# EAGLE design working (EAGLE 6.3)
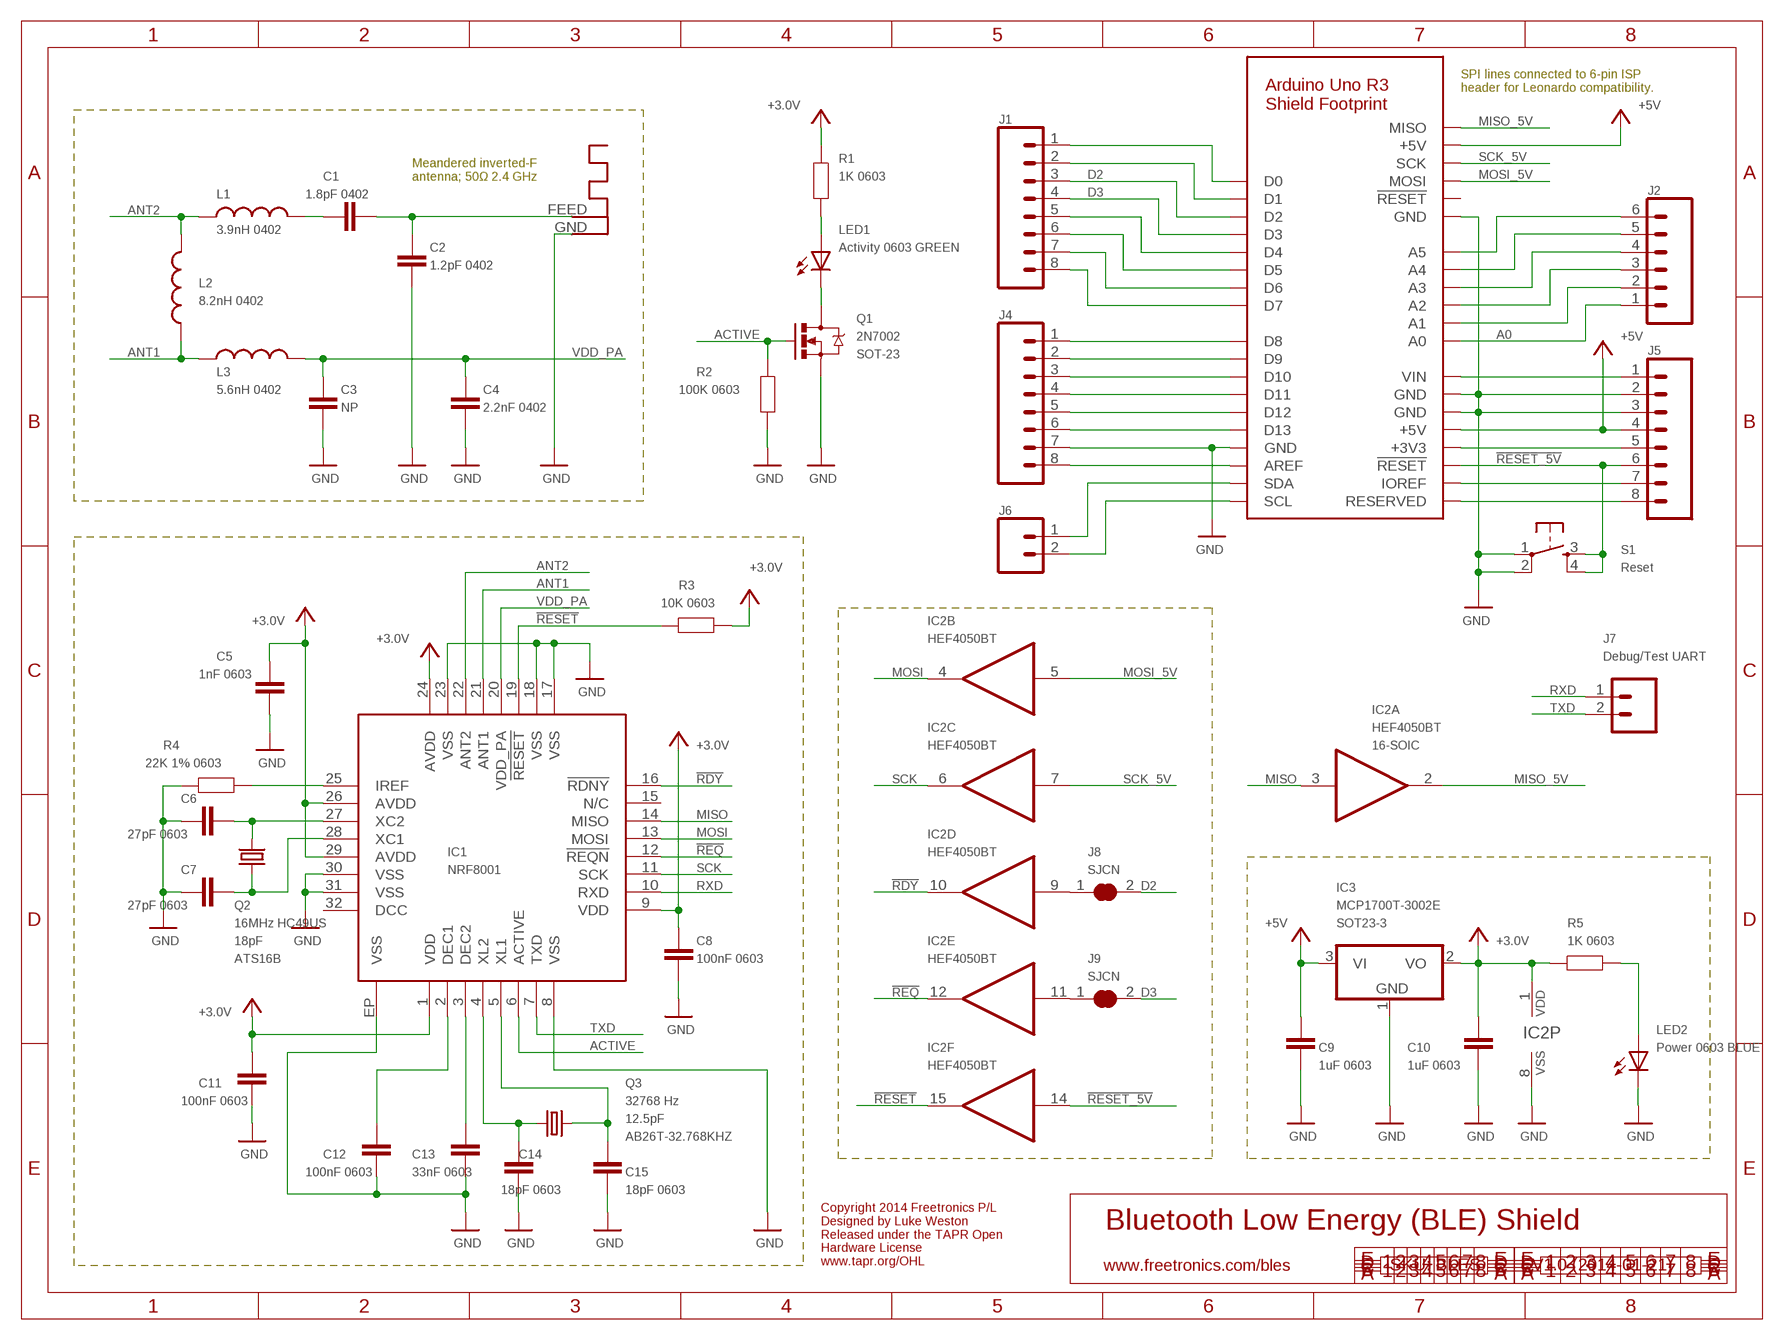
[diagram p0: schematic, sheet 1]

## Parts
ANT1  ANTENNA  [RN-ANT]
C1  1.8pF 0402  CAP0402  [C0402]
C2  1.2pF 0402  CAP0402  [C0402]
C3  NP  CAP0402  [C0402]
C4  2.2nF 0402  CAP0402  [C0402]
C5  1nF 0603  CAP0603  [0603]
C6  27pF 0603  CAP0603  [0603]
C7  27pF 0603  CAP0603  [0603]
C8  100nF 0603  CAP0603  [0603]
C9  1uF 0603  CAP0603  [0603]
C10  1uF 0603  CAP0603  [0603]
C11  100nF 0603  CAP0603  [0603]
C12  100nF 0603  CAP0603  [0603]
C13  33nF 0603  CAP0603  [0603]
C14  18pF 0603  CAP0603  [0603]
C15  18pF 0603  CAP0603  [0603]
IC1  NRF8001  FITNESSDEVICE_NRF8001  [FITNESSDEVICE_QFN-32]
IC2  HEF4050BT  4050D  [SO16]
IC3  MCP1700T-3002E  MCP1703CB  [SOT23]
J1  M08STD  [1X08]
J2  M06SIP  [1X06]
J3  ARDUINO-SHIELD_R3  [ARDUINO-SHIELD_R3]
J4  M08STD  [1X08]
J5  M08STD  [1X08]
J6  M02PTH  [1X02]
J7  Debug/Test UART  M02PTH  [1X02]
J8  SJCN  [SJC]
J9  SJCN  [SJC]
L1  3.9nH 0402  INDUCTOR0402  [C0402]
L2  8.2nH 0402  INDUCTOR0402  [C0402]
L3  5.6nH 0402  INDUCTOR0402  [C0402]
LED1  Activity 0603 GREEN  LED0603  [LED-0603]
LED2  Power 0603 BLUE  LED0603  [LED-0603]
Q1  2N7002  [SOT23-3]
Q2  16MHz HC49US  CRYSTALHC49UV  [HC49U-V]
Q3  32768 Hz  CRYSTALTC26H  [TC26H]
R1  1K 0603  RESISTOR0603  [0603]
R2  100K 0603  RESISTOR0603  [0603]
R3  10K 0603  RESISTOR0603  [0603]
R4  22K 1% 0603  RESISTOR0603  [0603]
R5  1K 0603  RESISTOR0603  [0603]
S1  Reset  TAC_SWITCHSMD  [TACTILE_SWITCH_SMD]

## Nets
!RDY: IC1.16(!RDNY) IC2.10(D:O)
!REQ: IC1.12(!REQN) IC2.12(E:O)
!RESET: IC1.19(!RESET) IC2.15(F:O) R3.2
!RESET_5V: IC2.14(F:I) J3.!RESET J5.6 S1.3 S1.4
+3.0V: C5.2 C8.2 C10.2 C11.2 IC1.1(VDD) IC1.9(VDD) IC1.24(AVDD) IC1.26(AVDD) IC1.29(AVDD) IC2.1(P:VDD) IC3.2(VO) R1.1 R3.1 R5.2
+3.3V: J3.3V3(+3V3) J5.5
+5V: C9.2 IC3.3(VI) J3.+5V J3.+5V@0(+5V) J5.4
A0: J2.1 J3.A0
ACTIVE: IC1.6(ACTIVE) Q1.1(G) R2.1
ANT1: IC1.21(ANT1) L2.2 L3.1
ANT2: IC1.22(ANT2) L1.2 L2.1
C: IC2.9(D:I) J8.1
D: IC2.11(E:I) J9.1
D2: J1.3 J3.D2 J8.2
D3: J1.4 J3.D3 J9.2
GND: ANT1.GND C2.1 C3.1 C4.1 C5.1 C6.1 C7.1 C8.1 C9.1 C10.1 C11.1 C12.1 C13.1 C14.1 C15.1 IC1.8(VSS) IC1.17(VSS) IC1.18(VSS) IC1.23(VSS) IC1.30(VSS) IC1.31(VSS) IC1.EP(VSS) IC2.8(P:VSS) IC3.1(GND) J3.GND J3.GND@0(GND) J3.GND@1(GND) J3.GND@2(GND) J4.7 J5.2 J5.3 LED2.C Q1.2(S) R2.2 R4.2 S1.1 S1.2
MISO: IC1.14(MISO) IC2.3(A:I)
MISO_5V: IC2.2(A:O) J3.MISO
MOSI: IC1.13(MOSI) IC2.4(B:O)
MOSI_5V: IC2.5(B:I) J3.MOSI
N$1: C12.2 IC1.2(DEC1)
N$2: C13.2 IC1.3(DEC2)
N$3: IC1.25(IREF) R4.1
N$4: C7.2 IC1.28(XC1) Q2.1
N$5: C6.2 IC1.27(XC2) Q2.2
N$6: C14.2 IC1.4(XL2) Q3.1
N$7: C15.2 IC1.5(XL1) Q3.2
N$8: ANT1.FEED C1.1 C2.2
N$13: C1.2 L1.1
N$14: LED2.A R5.1
N$15: LED1.C Q1.3(D)
N$17: LED1.A R1.2
N$27: J2.2 J3.A1
N$37: J2.3 J3.A2
N$50: J2.4 J3.A3
N$72: J2.5 J3.A4
N$73: J2.6 J3.A5
N$74: J3.RESERVED J5.8
N$75: J3.VIN J5.1
N$81: J3.IOREF J5.7
N$82: J1.1 J3.D0
N$87: J1.2 J3.D1
N$90: J1.5 J3.D4
N$123: J1.6 J3.D5
N$124: J1.7 J3.D6
N$125: J1.8 J3.D7
N$126: J3.SDA J6.1
N$127: J3.AREF J4.8
N$128: J3.D13 J4.6
N$129: J3.D12 J4.5
N$130: J3.SCL J6.2
N$131: J3.D8 J4.1
N$132: J3.D9 J4.2
N$133: J3.D10 J4.3
N$134: J3.D11 J4.4
RXD: IC1.10(RXD) J7.1
SCK: IC1.11(SCK) IC2.6(C:O)
SCK_5V: IC2.7(C:I) J3.SCK
TXD: IC1.7(TXD) J7.2
VDD_PA: C3.2 C4.2 IC1.20(VDD_PA) L3.2
Unconnected: IC1.15(N/C) IC1.32(DCC) J3.!RESET@0(!RESET)

## Notes on the sheet
- SPI lines connected to 6-pin ISP
  header for Leonardo compatibility.
- Meandered inverted-F
  antenna; 50Ω 2.4 GHz
- Bluetooth Low Energy (BLE) Shield
- Copyright 2014 Freetronics P/L
  Designed by Luke Weston
  Released under the TAPR Open
  Hardware License
  www.tapr.org/OHL
- www.freetronics.com/bles | SKU: BLES | V1.0 (2014-01-21)

## Library data of the parts
ANT1 = adafruit:ANTENNA
C1-C4 = freetronics-master-v1:CAP: Capacitor Standard 0603 ceramic capacitor, and 0.1" leaded capacitor.; PACKAGE: 0402
C5-C15 = freetronics-master-v1:CAP: Capacitor Standard 0603 ceramic capacitor, and 0.1" leaded capacitor.; PACKAGE: 0603
IC1 = bluetooth:FITNESSDEVICE_NRF8001: nRF8001 is a Bluetooth® low energy solution designed for operation in the peripheral role. By integrating a Bluetooth low energy compliant radio (PHY), slave mode link controller and host, nRF8001 offers you an easy way to add Bluetooth low energy connectivity to your application.; VALUE2: NRF8001
IC2 = 40xx:4050: Hex non-inverting BUFFER; PACKAGE: 16-SOIC
IC3 = linear:MCP1703: 250 mA, 16V, Low Quiescent Current LDO Regulator Source: http://ww1.microchip.com/downloads/en/DeviceDoc/22049b.pdf; PACKAGE: SOT23-3
J1 J4 J5 = freetronics-master-v1:M08: Header 8 Standard 8-pin 0.1" header. Use with straight break away headers (SKU : PRT-00116), right angle break away headers (PRT-00553), swiss pins (PRT-00743), machine pins (PRT-00117), and female headers (PRT-00115).
J2 = freetronics-master-v1:M06: Header 6 Standard 6-pin 0.1" header. Use with straight break away headers (SKU : PRT-00116), right angle break away headers (PRT-00553), swiss pins (PRT-00743), machine pins (PRT-00117), and female headers (PRT-00115). Molex polarized connector foot print use with SKU : PRT-08094 with associated crimp pins and housings. NOTES ON THE VARIANTS LOCK and LOCK_LONGPADS... This footprint was designed to help hold the alignment of a through-hole component (i.e. 6-pin header) while soldering it into place. You may notice that each hole has been shifted either up or down by 0.005 of an inch from it's more standard position (which is a perfectly straight line). This slight alteration caused the pins (the squares in the middle) to touch the edges of the holes. Because they are alternating, it causes a "brace" to hold the component in place. 0.005 has proven to be the perfect amount of "off-center" position when using our standard breakaway headers. Although looks a little odd when you look at the bare footprint, once you have a header in there, the alteration is very hard to notice. Also, if you push a header all the way into place, it is covered up entirely on the bottom side. This idea of altering the position of holes to aid alignment will be further integrated into the Sparkfun Library for other footprints. It can help hold any component with 3 or more connection pins.
J3 = freetronics-luke:ARDUINO-SHIELD_R3: Arduino Uno/Eleven/Leonardo shield, R3 compatible.
J6 J7 = freetronics-master-v1:M02: Header 2 Standard 2-pin 0.1" header. Use with straight break away headers (SKU : PRT-00116), right angle break away headers (PRT-00553), swiss pins (PRT-00743), machine pins (PRT-00117), and female headers (PRT-00115). Molex polarized connector foot print use with SKU : PRT-08233 with associated crimp pins and housings.
J8 J9 = freetronics-jon:SJC
L1-L3 = freetronics-master-v1:INDUCTOR: Inductors Basic Inductor/Choke - 0603 and 1206. Footprints are not proven and vary greatly between part numbers.; PACKAGE: 0402
LED1 = freetronics-master-v1:LED: LEDs Standard schematic elements and footprints for 5mm, 3mm, 1206, and 0603 sized LEDs. 5mm - Spark Fun Electronics SKU : COM-00529 (and others); COLOUR: Green; PACKAGE: 0603
LED2 = freetronics-master-v1:LED: LEDs Standard schematic elements and footprints for 5mm, 3mm, 1206, and 0603 sized LEDs. 5mm - Spark Fun Electronics SKU : COM-00529 (and others); COLOUR: Blue; PACKAGE: 0603
Q1 = freetronics-luke:2N7002: 2N7002 N-ch MOSFET in SOT-23.; PACKAGE: SOT-23
Q2 = freetronics-master-v1:CRYSTAL: Crystals Various standard crystals. Proven footprints. Spark Fun Electronics SKU : COM-00534; CAPACITANCE: 18pF; ID: ATS16B; PACKAGE: HC49US
Q3 = SparkFun:CRYSTAL: Crystals Various standard crystals. Proven footprints. Spark Fun Electronics SKU : COM-00534; CAPACITANCE: 12.5pF; ID: AB26T-32.768KHZ
R1-R5 = freetronics-master-v1:RESISTOR: Resistor Basic schematic elements and footprints for 0603, 1206, and PTH 1/10th watt (small) resistors.; PACKAGE: 0603
S1 = freetronics:TAC_SWITCH: Momentary Switch Button commonly used for reset or general input. Spark Fun Electronics SKU : COM-00097

## Board
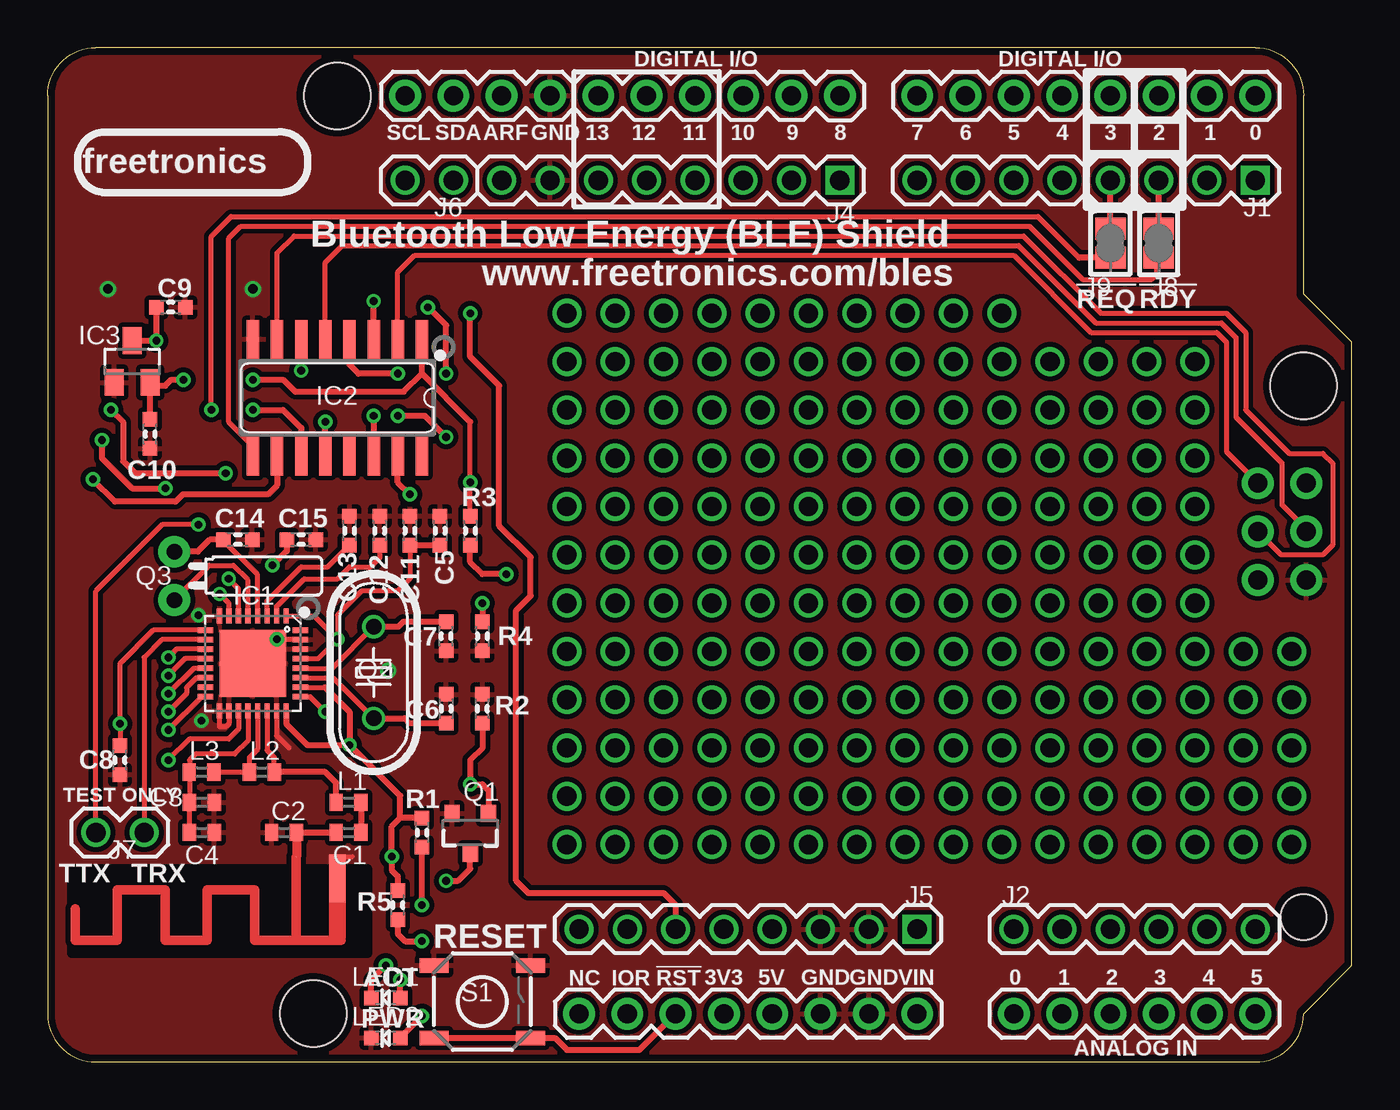
[diagram p1: board, top side]
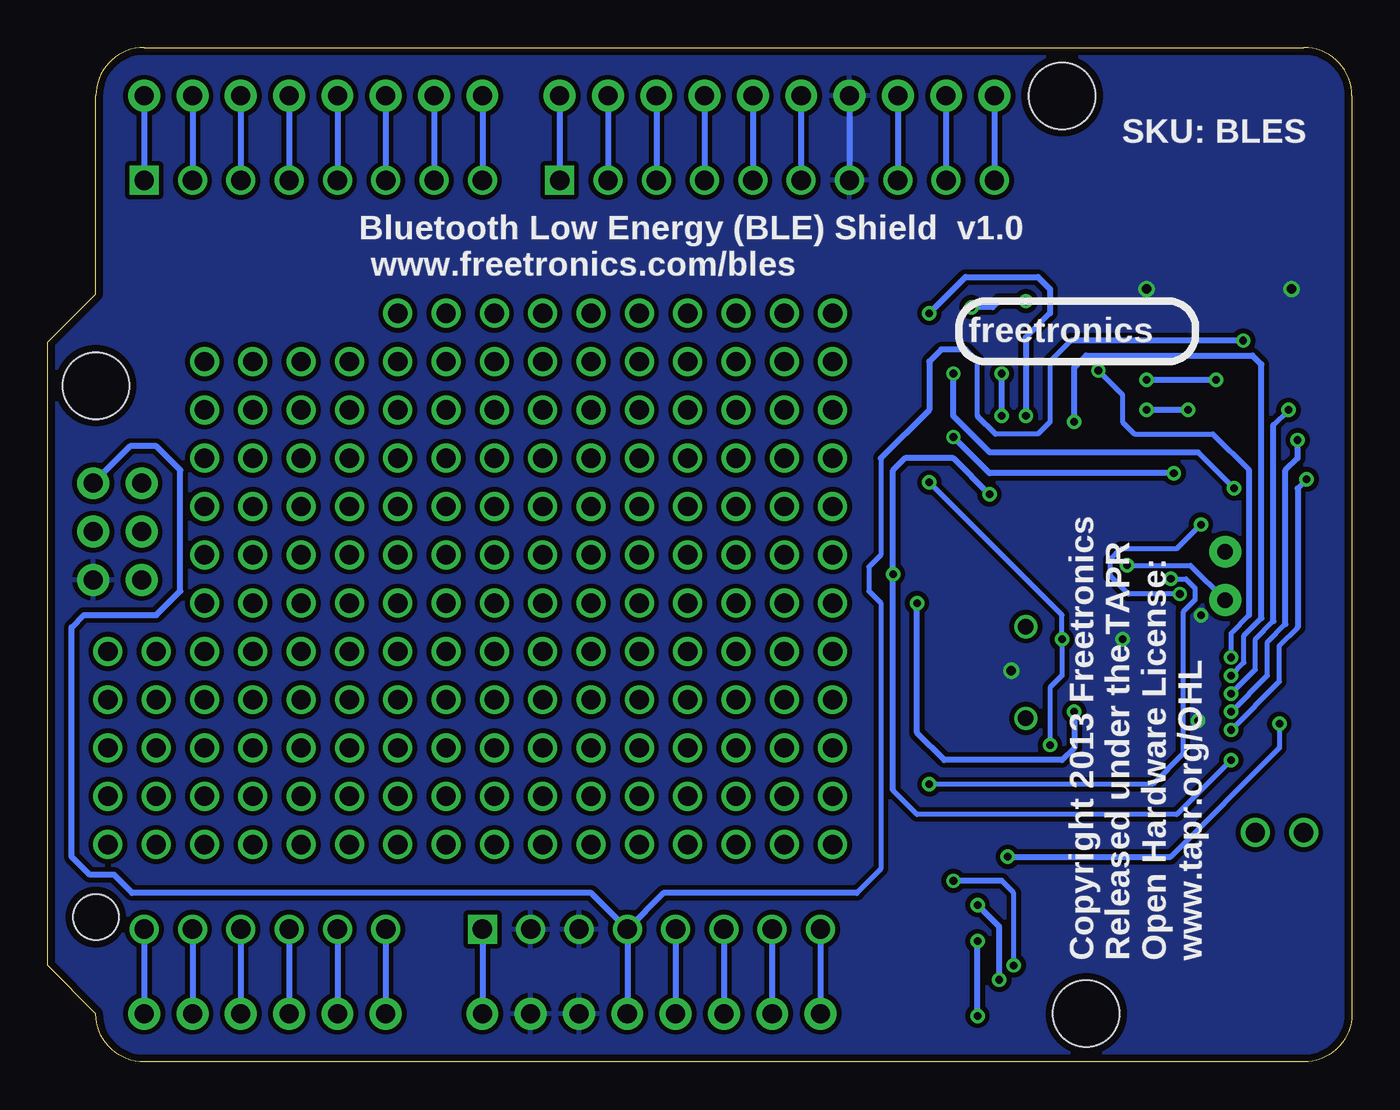
[diagram p2: board, bottom side, seen from below]

Size 68.58 x 53.34 mm. Coordinates in mm from the lower left corner, seen from the top.
Copper layers (1*16): Top 0.0356mm / dielectric 1.5011mm / Bottom 0.0356mm
Design rules "LaenPCBOrder *": minimum track width 6mil, minimum drill 13mil, track to track 6mil, track to pad 6mil, pad to pad 6mil, via to via 6mil, smd to smd 6mil, copper to edge 15mil, drill to drill 6mil, minimum pad ring 7mil, minimum via ring 7mil, stop-mask expansion 4mil, vias tented up to drill 16mil, thermal gap 10mil
tRestrict: area 1.3,5.7 to 16.8,10.2

### Footprints (pad centres in the part's own frame; a part is rotated, then mirrored left to right if it is on the bottom)
RN-ANT = smd 0.025 x 0.025: FEED 0,2.159 | smd 2.54 x 0.889: GND -1.143,0
C0402 = smd 0.7 x 0.9: 1 -0.65,0; 2 0.65,0
0603 = smd 0.762 x 0.762: 1 -0.762,0; 2 0.762,0
FITNESSDEVICE_QFN-32 = smd 0.285 x 0.8: 1 -1.75,-2.5; 2 -1.25,-2.5; 3 -0.75,-2.5; 4 -0.25,-2.5; 5 0.25,-2.5; 6 0.75,-2.5; 7 1.25,-2.5; 8 1.75,-2.5; 17 1.75,2.5; 18 1.25,2.5; 19 0.75,2.5; 20 0.25,2.5; 21 -0.25,2.5; 22 -0.75,2.5; 23 -1.25,2.5; 24 -1.75,2.5 | smd 0.8 x 0.285: 9 2.5,-1.75; 10 2.5,-1.25; 11 2.5,-0.75; 12 2.5,-0.25; 13 2.5,0.25; 14 2.5,0.75; 15 2.5,1.25; 16 2.5,1.75; 25 -2.5,1.75; 26 -2.5,1.25; 27 -2.5,0.75; 28 -2.5,0.25; 29 -2.5,-0.25; 30 -2.5,-0.75; 31 -2.5,-1.25; 32 -2.5,-1.75 | smd 3.5 x 3.5: EP 0,0
SO16 = smd 0.66 x 2.032: 1 -4.445,-3.073; 2 -3.175,-3.073; 3 -1.905,-3.073; 4 -0.635,-3.073; 5 0.635,-3.073; 6 1.905,-3.073; 7 3.175,-3.073; 8 4.445,-3.073; 9 4.445,3.073; 10 3.175,3.073; 11 1.905,3.073; 12 0.635,3.073; 13 -0.635,3.073; 14 -1.905,3.073; 15 -3.175,3.073; 16 -4.445,3.073
SOT23 = smd 1 x 1.4: 1 -0.95,-1.1; 2 0.95,-1.1; 3 0,1.1
1X08 = drill 1.016 square: 1 0,0 | drill 1.016: 2 2.54,0; 3 5.08,0; 4 7.62,0; 5 10.16,0; 6 12.7,0; 7 15.24,0; 8 17.78,0
1X06 = drill 1.016: 1 0,0; 2 2.54,0; 3 5.08,0; 4 7.62,0; 5 10.16,0; 6 12.7,0
ARDUINO-SHIELD_R3 = drill 1 pad 1.676: 3V3 0,-24.13; !RESET -2.54,-24.13; !RESET@0 28.08,-1.32; +5V 2.54,-24.13; +5V@0 30.62,3.76; A0 15.24,-24.13; A1 17.78,-24.13; A2 20.32,-24.13; A3 22.86,-24.13; A4 25.4,-24.13; A5 27.94,-24.13; AREF -11.684,24.13; D0 27.94,24.13; D1 25.4,24.13; D2 22.86,24.13; D3 20.32,24.13; D4 17.78,24.13; D5 15.24,24.13; D6 12.7,24.13; D7 10.16,24.13; D8 6.096,24.13; D9 3.556,24.13; D10 1.016,24.13; D11 -1.524,24.13; D12 -4.064,24.13; D13 -6.604,24.13; GND 7.62,-24.13; GND@0 5.08,-24.13; GND@1 -9.144,24.13; GND@2 30.62,-1.32; IOREF -5.08,-24.13; MISO 28.08,3.76; MOSI 30.62,1.22; RESERVED -7.62,-24.13; SCK 28.08,1.22; SCL -16.764,24.13; SDA -14.224,24.13; VIN 10.16,-24.13 | hole 3.5: 30.48,8.89; -20.32,24.13; -21.59,-24.13 | hole 2.4: 30.48,-19.05
1X02 = drill 1.016: 1 0,0; 2 2.54,0
SJC = smd 1.168 x 1.6: 1 -0.762,0; 2 0.762,0
LED-0603 = smd 0.762 x 0.762: A -0.762,0; C 0.762,0
SOT23-3 = smd 0.8 x 0.9: 1 -0.95,-1; 2 0.95,-1; 3 0,1.1
HC49U-V = drill 0.813: 1 -2.413,0; 2 2.413,0
TC26H = drill 0.813 pad 1.676: 1 -1.27,0; 2 1.27,0
TACTILE_SWITCH_SMD = smd 1.524 x 0.762: 1 -2.54,1.905; 2 2.54,1.905; 3 -2.54,-1.905; 4 2.54,-1.905

### Placement (x,y rotation side)
ANT1  15.24,10.79 90 top
C1  15.82,12.06 0 top
C2  12.43,12.06 0 top
C3  8.12,13.65 180 top
C4  8.12,12.06 180 top
C5  20.64,27.94 270 top
C6  20.95,18.57 270 top
C7  20.95,22.38 90 top
C8  3.81,15.88 90 top
C9  6.48,39.69 180 top
C10  5.39,33.02 90 top
C11  19.05,27.94 270 top
C12  17.46,27.94 270 top
C13  15.88,27.94 270 top
C14  10,27.46 180 top
C15  13.34,27.46 180 top
IC1  10.79,20.95 180 top
IC2  15.24,34.92 180 top
IC3  4.45,36.83 0 top
J1  63.5,46.35 180 top
J2  50.8,6.99 0 top
J3  35.56,26.67 0 top
J4  41.66,46.35 180 top
J5  45.72,6.99 180 top
J6  21.34,46.35 180 top
J7  5.08,12.06 180 top
J8  58.42,43.05 90 top
J9  55.88,43.05 90 top
L1  15.82,13.65 180 top
L2  11.27,15.24 180 top
L3  8.1,15.24 180 top
LED1  17.78,3.37 180 top
LED2  17.78,1.27 180 top
Q1  22.23,12.06 180 top
Q2  17.14,20.48 270 top
Q3  6.67,25.56 270 top
R1  19.68,12.06 270 top
R2  22.86,18.57 90 top
R3  22.23,27.94 270 top
R4  22.86,22.38 270 top
R5  18.41,8.26 90 top
S1  22.86,3.17 0 top

### Tracks (layer width: path | path; a pad name or v marks a point on that pad's centre or on a via)
!RDY  (via drill 0.4 pad 0.61)
  Top 0.254: IC1.16 8.09,19.2 v6.35,17.46
  Top 0.305: IC2.10 12.06,30.32 11.59,29.84 7.11,29.84 6.73,29.46 3.56,29.46 v2.38,30.64
  Bottom 0.254: v6.35,17.46 3.81,20 3.81,21.91 2.86,22.86 | v2.38,30.64 2.86,30.16
  Bottom 0.305: 2.86,30.16 2.86,22.86
!REQ  (via drill 0.4 pad 0.61)
  Top 0.254: IC1.12 7.24,21.2 v6.35,20.32
  Top 0.305: IC2.12 v14.61,33.66
  Bottom 0.254: v6.35,20.32 5.67,21 5.67,22.42 4.76,23.34
  Bottom 0.305: 4.76,23.34 4.76,36.67 5.24,37.15 13.97,37.15 14.61,36.51 v14.61,33.66
!RESET  (via drill 0.4 pad 0.61)
  Top 0.254: IC1.19 10.04,17.51 9.53,16.99 7.46,16.99 v6.35,15.88 | 18.41,31.11 IC2.15 | R3.2 22.23,27.15
  Top 0.305: v19.05,29.84 18.41,30.48 IC2.15 | v24.13,25.65 22.86,25.65 22.23,26.29 R3.2
  Bottom 0.254: v6.35,15.88 9.21,13.02 22.86,13.02 24.13,14.29
  Bottom 0.305: 24.13,14.29 v24.13,25.65 24.13,31.11 23.5,31.75 20.95,31.75 v19.05,29.84
!RESET_5V  (via drill 0.4)
  Top 0.305: v17.14,33.97 IC2.14 | v22.23,39.37 22.23,37.08 23.75,35.56 23.75,28.19 25.4,26.54 25.4,24.51 24.64,23.75 24.64,9.53 25.27,8.89 32.38,8.89 33.02,8.26 J5.6 | J3.!RESET 31.11,0.64 27.3,0.64 26.67,1.27 S1.4 S1.3
  Bottom 0.305: J5.6 J3.!RESET | v22.23,39.37 20.32,41.27 16.51,41.27 15.88,40.64 15.88,39.37 17.14,38.1 v17.14,33.97
+3.0V  (via drill 0.4 pad 0.61)
  Top 0.254: 5.57,35.56 IC3.2 | IC1.9 5.56,22.7 3.81,20.95 v3.81,17.78 C8.2 | IC1.26 14.59,19.7 | IC1.29 14.22,21.2 v15.24,22.23 | IC1.1 14.01,23.45 v15.24,22.23 | C11.2 19.05,25.4 18.41,24.77 16.51,24.77 15.24,23.5 v15.24,22.23 | R3.1 v22.23,30.48 22.23,33.66
  Top 0.305: C10.2 IC3.2 | IC1.24 12.54,17.78 13.65,16.67 v15.88,16.67 | 19.68,36.2 18.73,35.24 13.02,35.24 12.38,35.88 v10.79,35.88 | 5.57,35.56 6.19,35.56 6.51,35.88 v7.14,35.88 | 14.59,19.7 15.88,18.41 v15.88,16.67 | C11.2 C5.2 | v15.88,16.67 18.54,14 18.54,12.83 | 22.23,33.66 19.68,36.2 | R1.1 18.54,12.83 | 18.54,12.83 18.1,12.38 v18.1,10.79 18.1,10.08 18.41,9.76 R5.2 | 19.68,36.2 IC2.1
  Top 0.406: IC3.2
  Bottom 0.254: v22.23,30.48 15.24,23.5 v15.24,22.23 15.24,20.32 15.88,19.68 v15.88,16.67 | 9.53,10.79 3.81,16.51 v3.81,17.78
  Bottom 0.305: v10.79,35.88 v7.14,35.88 | v18.1,10.79 9.53,10.79
+3.3V
  Bottom 0.305: J5.5 J3.3V3
+5V  (via drill 0.4)
  Top 0.305: IC3.3 v5.71,37.93 C9.2
  Bottom 0.254: 14.78,37.93 15.88,36.83 15.88,33.66 16.51,33.02 18.73,33.02 | 19.68,33.97 19.68,36.83 | 24.77,31.75 24.77,26.67 25.4,26.04 25.4,24.77 24.77,24.13 24.77,10.16 26.04,8.89
  Bottom 0.305: v5.71,37.93 14.78,37.93 | 18.73,33.02 19.68,33.97 | J5.4 J3.+5V | J5.4 40.01,8.89 64.14,8.89 65.09,9.84 66.36,9.84 67.31,10.79 67.31,22.86 66.67,23.5 62.87,23.5 61.59,24.77 61.59,31.11 62.87,32.38 64.22,32.38 J3.+5V@0 | 19.68,36.83 20.32,37.47 21.59,37.47 22.23,36.83 22.23,34.29 24.77,31.75 | 26.04,8.89 36.2,8.89 J5.4
A0
  Bottom 0.305: J2.1 J3.A0
ACTIVE  (via drill 0.4 pad 0.61)
  Top 0.254: IC1.6 10.04,24.88 v9.53,25.4 | Q1.1
  Top 0.305: Q1.1 23.18,14.29 22.86,14.61 v22.23,14.61 22.23,15.88 22.86,16.51 R2.1
  Bottom 0.254: v9.53,25.4 8.73,25.4 8.26,24.92 8.26,24.29 8.89,23.65 8.89,16.19 10.48,14.61 v22.23,14.61
ANT1
  Top 0.254: IC1.21 11.04,16.44 10.62,16.02 L2.2 L3.1
ANT2
  Top 0.254: IC1.22 11.54,16.39 11.92,16.02 L2.1
  Top 0.305: L1.2 15.17,14.67 14.61,15.24 L2.1
C
  Top 0.254: 10.79,32.38 9.53,33.66 9.53,43.31 10.16,43.94 51.63,43.94 54.42,41.15 58.05,41.15 58.33,41.43 58.33,41.94 J8.1
  Top 0.406: 10.79,32.38 IC2.9
D  (via drill 0.4)
  Top 0.254: v8.61,34.29 8.61,43.41 9.65,44.45 52.07,44.45 54.23,42.29
  Top 0.305: v10.79,34.29 12.38,34.29 13.34,33.34 IC2.11 | J9.1 54.23,42.29
  Bottom 0.305: v8.61,34.29 v10.79,34.29
D2
  Top 0.305: J8.2 J1.3
  Bottom 0.305: J3.D2 J1.3
D3
  Top 0.305: J9.2 J1.4
  Bottom 0.305: J3.D3 J1.4
GND  (via drill 0.4 pad 0.61, 0.5)
  Top 0.254: ANT1.GND 15.37,9.65 15.24,9.68 15.24,10 | 15.24,10 15.24,10.64 15.4,10.79 16.03,10.79 | 15.24,10 15.4,10 | IC1.18 9.54,17.8 9.37,17.62 9.05,17.62 9.05,18.41 | IC1.23 12.04,17.16 12.7,16.51 | IC1.31 12.09,22.2 v12.06,22.23 IC1.EP
  Bottom 0.305: J3.GND@1 J4.7
  other vias: 8.1,17.94 7.94,23.5 10.79,40.64 17.91,20.57 3.17,40.64
  pour Bottom (isolate 0.254): 0,53.34 68.58,53.34 68.58,0 0,0
  pour Top (isolate 0.254): 0,53.34 68.58,53.34 68.58,0 0,0
MISO  (via drill 0.4, 0.4 pad 0.61)
  Top 0.254: IC1.14 7.82,20.2 7.3,19.68 7.3,19.37 v6.35,18.41
  Top 0.305: v2.86,32.7 2.86,31.75 4.45,30.16 v6.19,30.16 | IC2.3 v17.14,40.01 | v20.95,36.2 20.95,38.73 v20,39.69
  Bottom 0.254: v6.35,18.41 4.45,20.32 4.45,22.07 3.49,23.02 | 8.1,32.07 v6.19,30.16
  Bottom 0.305: 3.49,23.02 3.49,31.11 2.86,31.75 v2.86,32.7 | v17.14,40.01 18.57,40.01 18.89,39.69 v20,39.69 | 8.1,32.07 19.05,32.07 20.95,33.97 v20.95,36.2
MISO_5V
  Top 0.254: IC2.2 18.41,41.53 19.3,42.42 50.8,42.42 54.86,38.35 61.47,38.35 61.98,37.85 61.98,32.09 J3.MISO
MOSI  (via drill 0.4 pad 0.61)
  Top 0.254: IC1.13 7.69,20.7 v6.35,19.37
  Top 0.305: v3.33,34.29 3.97,33.66 3.97,31.59 4.6,30.96 v9.37,30.96 | v20.95,32.86 19.84,33.97 v18.41,33.97 | v18.41,36.2 16.35,36.2 15.88,36.67 IC2.4
  Bottom 0.254: v6.35,19.37 5.08,20.64 5.08,22.23 4.13,23.18 | 4.13,33.5 v3.33,34.29
  Bottom 0.305: 4.13,23.18 4.13,33.5 | v18.41,33.97 v18.41,36.2 | v9.37,30.96 19.05,30.96 v20.95,32.86
MOSI_5V
  Top 0.254: IC2.5 14.61,42.04 15.49,42.93 51.05,42.93 55.12,38.86 61.72,38.86 62.48,38.1 62.48,33.91 64.9,31.5 64.9,29.3 66.09,28.11 66.09,27.98 J3.MOSI
N$1
  Top 0.254: IC1.2 12.04,23.95 13.49,25.4 15.24,25.4 15.88,26.04 16.99,26.04 17.46,26.51 C12.2
N$2
  Top 0.254: IC1.3 11.54,24.25 13.34,26.04 14.73,26.04 C13.2
N$3  (via drill 0.4 pad 0.61)
  Top 0.254: IC1.25 13.81,19.2 v14.61,18.41
  Top 0.305: v22.86,24.13 R4.1
  Bottom 0.305: v22.86,24.13 22.86,17.3 21.43,15.88 15.24,15.88 14.61,16.51 v14.61,18.41
N$4
  Top 0.254: IC1.28 14.96,20.7 Q2.1
  Top 0.305: Q2.1 18.45,22.89 18.7,23.15 C7.2
N$5
  Top 0.254: IC1.27 15.01,20.2 Q2.2
  Top 0.305: Q2.2 18.76,18.07 19.02,17.81 C6.2
N$6
  Top 0.254: C14.2 9.24,27.43 11.04,25.63 IC1.4
  Top 0.305: C14.2 8.53,27.46 7.9,26.83 Q3.1
N$7  (via drill 0.4)
  Top 0.254: IC1.5 10.54,25.33 9.76,26.11 8.49,26.11 Q3.2
  Top 0.305: C15.2 12.57,26.86 v11.83,26.11
  Bottom 0.254: v11.83,26.11 8.49,26.11 Q3.2
N$8
  Top 0.254: ANT1.FEED
  Top 0.305: C2.2 C1.1
  Top 0.483: C2.2 ANT1.FEED
N$13
  Top 0.305: L1.1 C1.2
N$14  (via drill 0.4)
  Top 0.254: LED2.A
  Top 0.305: LED2.A v19.68,2.42 | R5.1 18.41,6.75 18.81,6.35 v19.68,6.35
  Bottom 0.305: v19.68,2.42 v19.68,6.35
N$15  (via drill 0.4)
  Top 0.305: LED1.C 17.02,4.32 v17.78,5.08 | v20.95,9.53 21.59,9.53 22.23,10.16 Q1.3
  Bottom 0.254: v17.78,5.08 17.78,8.89 18.41,9.53
  Bottom 0.305: 18.41,9.53 v20.95,9.53
N$17  (via drill 0.4)
  Top 0.305: LED1.A v18.54,4.32 | v19.68,8.26 R1.2
  Bottom 0.305: v18.54,4.32 18.54,7.11 v19.68,8.26
N$18  (via drill 1.02)
  other vias: 55.24,36.83
N$19  (via drill 1.02)
  other vias: 57.78,34.29
N$20  (via drill 1.02)
  other vias: 27.3,36.83
N$21  (via drill 1.02)
  other vias: 27.3,34.29
N$23  (via drill 1.02)
  other vias: 27.3,31.75
N$24  (via drill 1.02)
  other vias: 27.3,29.21
N$25  (via drill 1.02)
  other vias: 29.84,36.83
N$26  (via drill 1.02)
  other vias: 32.38,36.83
N$27
  Bottom 0.305: J2.2 J3.A1
N$28  (via drill 1.02)
  other vias: 34.92,36.83
N$29  (via drill 1.02)
  other vias: 34.92,34.29
N$30  (via drill 1.02)
  other vias: 32.38,34.29
N$37
  Bottom 0.305: J2.3 J3.A2
N$40  (via drill 1.02)
  other vias: 29.84,34.29
N$41  (via drill 1.02)
  other vias: 50.16,36.83
N$45  (via drill 1.02)
  other vias: 52.7,34.29
N$50
  Bottom 0.305: J2.4 J3.A3
N$51  (via drill 1.02)
  other vias: 57.78,31.75
N$52  (via drill 1.02)
  other vias: 52.7,31.75
N$54  (via drill 1.02)
  other vias: 52.7,29.21
N$59  (via drill 1.02)
  other vias: 52.7,26.67
N$60  (via drill 1.02)
  other vias: 52.7,24.13
N$61  (via drill 1.02)
  other vias: 57.78,29.21
N$62  (via drill 1.02)
  other vias: 57.78,26.67
N$63  (via drill 1.02)
  other vias: 62.87,19.05
N$64  (via drill 1.02)
  other vias: 65.41,19.05
N$65  (via drill 1.02)
  other vias: 27.3,26.67
N$66  (via drill 1.02)
  other vias: 27.3,24.13
N$67  (via drill 1.02)
  other vias: 27.3,21.59
N$68  (via drill 1.02)
  other vias: 29.84,31.75
N$69  (via drill 1.02)
  other vias: 37.47,36.83
N$70  (via drill 1.02)
  other vias: 27.3,11.43
N$71  (via drill 1.02)
  other vias: 29.84,11.43
N$72
  Bottom 0.305: J2.5 J3.A4
N$73
  Bottom 0.305: J2.6 J3.A5
N$74
  Bottom 0.305: J5.8 J3.RESERVED
N$75
  Bottom 0.305: J5.1 J3.VIN
N$76  (via drill 1.02)
  other vias: 32.38,11.43
N$77  (via drill 1.02)
  other vias: 27.3,13.97
N$78  (via drill 1.02)
  other vias: 27.3,16.51
N$79  (via drill 1.02)
  other vias: 27.3,19.05
N$80  (via drill 1.02)
  other vias: 29.84,13.97
N$81
  Bottom 0.305: J5.7 J3.IOREF
N$82
  Bottom 0.305: J3.D0 J1.1
N$83  (via drill 1.02)
  other vias: 37.47,11.43
N$84  (via drill 1.02)
  other vias: 34.92,11.43
N$85  (via drill 1.02)
  other vias: 40.01,11.43
N$86  (via drill 1.02)
  other vias: 65.41,11.43
N$87
  Bottom 0.305: J3.D1 J1.2
N$88  (via drill 1.02)
  other vias: 62.87,11.43
N$89  (via drill 1.02)
  other vias: 62.87,13.97
N$90
  Bottom 0.305: J3.D4 J1.5
N$91  (via drill 1.02)
  other vias: 60.33,19.05
N$92  (via drill 1.02)
  other vias: 57.78,19.05
N$93  (via drill 1.02)
  other vias: 52.7,19.05
N$94  (via drill 1.02)
  other vias: 52.7,21.59
N$95  (via drill 1.02)
  other vias: 55.24,19.05
N$96  (via drill 1.02)
  other vias: 62.87,16.51
N$97  (via drill 1.02)
  other vias: 65.41,16.51
N$98  (via drill 1.02)
  other vias: 65.41,13.97
N$99  (via drill 1.02)
  other vias: 60.33,16.51
N$100  (via drill 1.02)
  other vias: 60.33,11.43
N$101  (via drill 1.02)
  other vias: 57.78,11.43
N$102  (via drill 1.02)
  other vias: 60.33,13.97
N$103  (via drill 1.02)
  other vias: 57.78,16.51
N$104  (via drill 1.02)
  other vias: 42.55,36.83
N$105  (via drill 1.02)
  other vias: 40.01,36.83
N$106  (via drill 1.02)
  other vias: 45.09,36.83
N$107  (via drill 1.02)
  other vias: 47.62,36.83
N$108  (via drill 1.02)
  other vias: 50.16,34.29
N$109  (via drill 1.02)
  other vias: 57.78,24.13
N$110  (via drill 1.02)
  other vias: 55.24,16.51
N$111  (via drill 1.02)
  other vias: 55.24,13.97
N$112  (via drill 1.02)
  other vias: 55.24,11.43
N$113  (via drill 1.02)
  other vias: 57.78,13.97
N$114  (via drill 1.02)
  other vias: 52.7,16.51
N$115  (via drill 1.02)
  other vias: 52.7,13.97
N$116  (via drill 1.02)
  other vias: 52.7,11.43
N$117  (via drill 1.02)
  other vias: 50.16,11.43
N$118  (via drill 1.02)
  other vias: 47.62,11.43
N$119  (via drill 1.02)
  other vias: 45.09,11.43
N$120  (via drill 1.02)
  other vias: 42.55,11.43
N$121  (via drill 1.02)
  other vias: 32.38,31.75
N$122  (via drill 1.02)
  other vias: 29.84,29.21
N$123
  Bottom 0.305: J3.D5 J1.6
N$124
  Bottom 0.305: J3.D6 J1.7
N$125
  Bottom 0.305: J3.D7 J1.8
N$126
  Bottom 0.305: J3.SDA J6.1
N$127
  Bottom 0.305: J3.AREF J4.8
N$128
  Bottom 0.305: J3.D13 J4.6
N$129
  Bottom 0.305: J3.D12 J4.5
N$130
  Bottom 0.305: J3.SCL J6.2
N$131
  Bottom 0.305: J3.D8 J4.1
N$132
  Bottom 0.305: J3.D9 J4.2
N$133
  Bottom 0.305: J3.D10 J4.3
N$134
  Bottom 0.305: J3.D11 J4.4
N$135  (via drill 1.02)
  other vias: 32.38,29.21
N$136  (via drill 1.02)
  other vias: 37.47,34.29
N$137  (via drill 1.02)
  other vias: 40.01,34.29
N$138  (via drill 1.02)
  other vias: 42.55,34.29
N$139  (via drill 1.02)
  other vias: 45.09,34.29
N$140  (via drill 1.02)
  other vias: 47.62,34.29
N$141  (via drill 1.02)
  other vias: 47.62,31.75
N$142  (via drill 1.02)
  other vias: 50.16,31.75
N$143  (via drill 1.02)
  other vias: 45.09,31.75
N$144  (via drill 1.02)
  other vias: 50.16,29.21
N$145  (via drill 1.02)
  other vias: 50.16,13.97
N$146  (via drill 1.02)
  other vias: 50.16,16.51
N$147  (via drill 1.02)
  other vias: 50.16,19.05
N$148  (via drill 1.02)
  other vias: 50.16,21.59
N$149  (via drill 1.02)
  other vias: 50.16,24.13
N$150  (via drill 1.02)
  other vias: 50.16,26.67
N$151  (via drill 1.02)
  other vias: 29.84,26.67
N$152  (via drill 1.02)
  other vias: 32.38,26.67
N$153  (via drill 1.02)
  other vias: 34.92,29.21
N$154  (via drill 1.02)
  other vias: 37.47,29.21
N$155  (via drill 1.02)
  other vias: 37.47,26.67
N$156  (via drill 1.02)
  other vias: 40.01,29.21
N$157  (via drill 1.02)
  other vias: 40.01,31.75
N$158  (via drill 1.02)
  other vias: 37.47,31.75
N$159  (via drill 1.02)
  other vias: 34.92,31.75
N$160  (via drill 1.02)
  other vias: 42.55,31.75
N$161  (via drill 1.02)
  other vias: 32.38,13.97
N$162  (via drill 1.02)
  other vias: 32.38,16.51
N$163  (via drill 1.02)
  other vias: 29.84,16.51
N$164  (via drill 1.02)
  other vias: 29.84,19.05
N$165  (via drill 1.02)
  other vias: 32.38,19.05
N$166  (via drill 1.02)
  other vias: 32.38,21.59
N$167  (via drill 1.02)
  other vias: 32.38,24.13
N$168  (via drill 1.02)
  other vias: 29.84,24.13
N$169  (via drill 1.02)
  other vias: 29.84,21.59
N$170  (via drill 1.02)
  other vias: 42.55,19.05
N$171  (via drill 1.02)
  other vias: 42.55,16.51
N$172  (via drill 1.02)
  other vias: 42.55,13.97
N$173  (via drill 1.02)
  other vias: 45.09,13.97
N$174  (via drill 1.02)
  other vias: 47.62,13.97
N$175  (via drill 1.02)
  other vias: 37.47,13.97
N$176  (via drill 1.02)
  other vias: 37.47,16.51
N$177  (via drill 1.02)
  other vias: 37.47,19.05
N$178  (via drill 1.02)
  other vias: 37.47,21.59
N$179  (via drill 1.02)
  other vias: 47.62,21.59
N$180  (via drill 1.02)
  other vias: 47.62,19.05
N$181  (via drill 1.02)
  other vias: 45.09,19.05
N$182  (via drill 1.02)
  other vias: 34.92,26.67
N$183  (via drill 1.02)
  other vias: 34.92,24.13
N$184  (via drill 1.02)
  other vias: 37.47,24.13
N$185  (via drill 1.02)
  other vias: 40.01,21.59
N$186  (via drill 1.02)
  other vias: 45.09,16.51
N$187  (via drill 1.02)
  other vias: 40.01,16.51
N$188  (via drill 1.02)
  other vias: 40.01,19.05
N$189  (via drill 1.02)
  other vias: 47.62,29.21
N$190  (via drill 1.02)
  other vias: 47.62,26.67
N$191  (via drill 1.02)
  other vias: 45.09,24.13
N$192  (via drill 1.02)
  other vias: 45.09,21.59
N$193  (via drill 1.02)
  other vias: 42.55,21.59
N$194  (via drill 1.02)
  other vias: 42.55,24.13
N$195  (via drill 1.02)
  other vias: 42.55,26.67
N$196  (via drill 1.02)
  other vias: 42.55,29.21
N$197  (via drill 1.02)
  other vias: 34.92,21.59
N$198  (via drill 1.02)
  other vias: 40.01,26.67
N$199  (via drill 1.02)
  other vias: 40.01,24.13
N$200  (via drill 1.02)
  other vias: 45.09,29.21
N$201  (via drill 1.02)
  other vias: 45.09,26.67
N$202  (via drill 1.02)
  other vias: 47.62,24.13
N$203  (via drill 1.02)
  other vias: 47.62,16.51
N$204  (via drill 1.02)
  other vias: 40.01,13.97
N$205  (via drill 1.02)
  other vias: 34.92,13.97
N$206  (via drill 1.02)
  other vias: 34.92,16.51
N$207  (via drill 1.02)
  other vias: 34.92,19.05
N$208  (via drill 1.02)
  other vias: 52.7,36.83
N$209  (via drill 1.02)
  other vias: 57.78,21.59
N$210  (via drill 1.02)
  other vias: 55.24,34.29
N$211  (via drill 1.02)
  other vias: 55.24,31.75
N$212  (via drill 1.02)
  other vias: 55.24,29.21
N$213  (via drill 1.02)
  other vias: 55.24,21.59
N$214  (via drill 1.02)
  other vias: 55.24,24.13
N$215  (via drill 1.02)
  other vias: 55.24,26.67
N$216  (via drill 1.02)
  other vias: 57.78,36.83
N$217  (via drill 1.02)
  other vias: 62.87,21.59
N$218  (via drill 1.02)
  other vias: 65.41,21.59
N$219  (via drill 1.02)
  other vias: 60.33,21.59
N$220  (via drill 1.02)
  other vias: 27.3,39.37
N$221  (via drill 1.02)
  other vias: 29.84,39.37
N$222  (via drill 1.02)
  other vias: 32.38,39.37
N$223  (via drill 1.02)
  other vias: 34.92,39.37
N$224  (via drill 1.02)
  other vias: 50.16,39.37
N$225  (via drill 1.02)
  other vias: 37.47,39.37
N$226  (via drill 1.02)
  other vias: 42.55,39.37
N$227  (via drill 1.02)
  other vias: 40.01,39.37
N$228  (via drill 1.02)
  other vias: 45.09,39.37
N$229  (via drill 1.02)
  other vias: 47.62,39.37
N$230  (via drill 1.02)
  other vias: 60.33,34.29
N$231  (via drill 1.02)
  other vias: 60.33,31.75
N$232  (via drill 1.02)
  other vias: 60.33,29.21
N$233  (via drill 1.02)
  other vias: 60.33,26.67
N$234  (via drill 1.02)
  other vias: 60.33,24.13
N$235  (via drill 1.02)
  other vias: 60.33,36.83
RXD
  Top 0.254: IC1.10 6.01,22.2 5.08,21.27 J7.1
SCK  (via drill 0.4 pad 0.61)
  Top 0.254: IC1.11 6.78,21.7 v6.35,21.27
  Top 0.305: v13.34,36.35 IC2.6
  Bottom 0.254: v6.35,21.27 6.35,22.54 5.4,23.5 | v13.34,36.35 12.06,35.08 12.06,33.66 11.43,33.02 7.3,33.02 5.4,31.11
  Bottom 0.305: 5.4,23.5 5.4,31.11
SCK_5V
  Top 0.254: IC2.7 12.06,42.55 12.95,43.43 51.31,43.43 55.37,39.37 61.98,39.37 62.99,38.35 62.99,34.29 65.28,32 67.06,32 67.56,31.5 67.56,27.18 67.06,26.67 64.86,26.67 J3.SCK
TXD  (via drill 0.4 pad 0.61)
  Top 0.254: IC1.7 9.54,24.11 v9.05,24.61 | v7.94,28.26 6.03,28.26 2.54,24.77 J7.2
  Bottom 0.254: v9.05,24.61 11.75,24.61 12.7,25.56 12.7,26.43 12.14,26.99 9.21,26.99 v7.94,28.26
VDD_PA
  Top 0.254: IC1.20 10.54,16.89 9.84,16.19 7.78,16.19 7.46,15.88 7.46,15.26 | 7.46,15.26 L3.2 | 7.46,15.26 C3.2 C4.2

### Text on the board
tPlace: freetronics | Bluetooth Low Energy (BLE) Shield | www.freetronics.com/bles | !REQ | !RDY | TEST ONLY | TTX | TRX | RESET | ACT | PWR
bPlace: SKU: BLES | Bluetooth Low Energy (BLE) Shield v1.0 | www.freetronics.com/bles | freetronics | Copyright 2013 Freetronics / Released under the TAPR / Open Hardware License: / www.tapr.org/OHL
tDocu: K | A | K | A